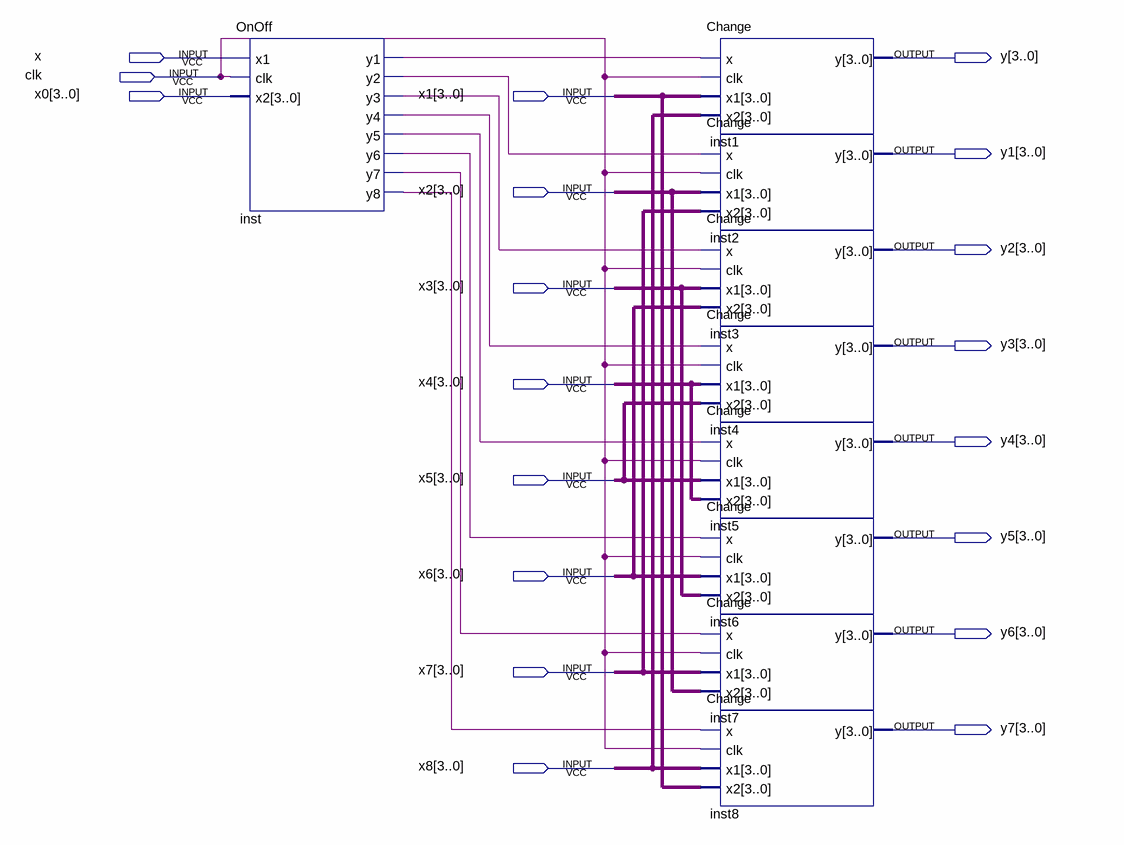
[diagram p0: schematic sheet]
// Quartus schematic 600-SwitchNum.bdf as structural Verilog: 9 symbols, 19 pins
module \600-SwitchNum  (
  input  x,
  input  clk,
  input  [3:0] x0,
  input  [3:0] x1,
  input  [3:0] x2,
  input  [3:0] x3,
  input  [3:0] x4,
  input  [3:0] x5,
  input  [3:0] x6,
  input  [3:0] x7,
  input  [3:0] x8,
  output [3:0] y,
  output [3:0] y1,
  output [3:0] y2,
  output [3:0] y3,
  output [3:0] y4,
  output [3:0] y5,
  output [3:0] y6,
  output [3:0] y7
);

  wire inst_y1, inst_y2, inst_y3, inst_y4, inst_y5, inst_y6, inst_y7, inst_y8;

  OnOff inst (
    .x1(x), .clk(clk), .x2(x0), .y1(inst_y1), .y2(inst_y2), .y3(inst_y3), .y4(inst_y4), .y5(inst_y5),
    .y6(inst_y6), .y7(inst_y7), .y8(inst_y8));
  Change inst1 (.x(inst_y1), .clk(clk), .x1(x1), .x2(x8), .y(y));
  Change inst2 (.x(inst_y2), .clk(clk), .x1(x2), .x2(x7), .y(y1));
  Change inst3 (.x(inst_y3), .clk(clk), .x1(x3), .x2(x6), .y(y2));
  Change inst4 (.x(inst_y4), .clk(clk), .x1(x4), .x2(x5), .y(y3));
  Change inst5 (.x(inst_y5), .clk(clk), .x1(x5), .x2(x4), .y(y4));
  Change inst6 (.x(inst_y6), .clk(clk), .x1(x6), .x2(x3), .y(y5));
  Change inst7 (.x(inst_y7), .clk(clk), .x1(x7), .x2(x2), .y(y6));
  Change inst8 (.x(inst_y8), .clk(clk), .x1(x8), .x2(x1), .y(y7));
endmodule
